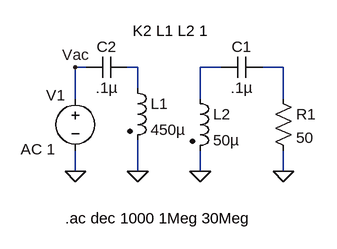
[diagram p0: schematic Transformer 50-450 Match.asc]
Transformer 50-450 Match.asc, the LTspice schematic file:
Version 4
SHEET 1 880 680
WIRE -112 112 -128 112
WIRE -32 112 -48 112
WIRE 96 112 64 112
WIRE 192 112 160 112
WIRE -32 144 -32 112
WIRE -128 160 -128 112
WIRE 64 160 64 112
WIRE 192 160 192 112
WIRE -128 272 -128 240
WIRE -32 272 -32 224
WIRE 64 272 64 240
WIRE 192 272 192 240
FLAG 64 272 0
FLAG -32 272 0
FLAG 192 272 0
FLAG -128 272 0
FLAG -128 112 Vac
SYMBOL ind2 -48 128 R0
SYMATTR InstName L1
SYMATTR Value 450µ
SYMATTR Type ind
SYMBOL ind2 48 144 R0
SYMATTR InstName L2
SYMATTR Value 50µ
SYMATTR Type ind
SYMBOL res 176 144 R0
SYMATTR InstName R1
SYMATTR Value 50
SYMBOL cap 160 96 R90
WINDOW 0 0 32 VBottom 2
WINDOW 3 32 32 VTop 2
SYMATTR InstName C1
SYMATTR Value .1µ
SYMBOL voltage -128 144 R0
WINDOW 0 -45 11 Left 2
WINDOW 3 -214 95 Left 2
WINDOW 123 -84 94 Left 2
WINDOW 39 -214 151 Left 2
SYMATTR InstName V1
SYMATTR Value ""
SYMATTR Value2 AC 1
SYMBOL cap -48 96 R90
WINDOW 0 0 32 VBottom 2
WINDOW 3 32 32 VTop 2
SYMATTR InstName C2
SYMATTR Value .1µ
TEXT -40 56 Left 2 !K2 L1 L2 1
TEXT -144 344 Left 2 !.ac dec 1000 1Meg 30Meg

The netlist it stands for:
* Transformer 50-450 Match.asc
L1 N001 0 450µ
L2 N002 0 50µ
R1 N003 0 50
C1 N003 N002 .1µ
V1 Vac 0 AC 1
C2 N001 Vac .1µ
K2 L1 L2 1
.ac dec 1000 1Meg 30Meg
.backanno
.end